# EAGLE design de1_breakout (EAGLE 6.5.0)
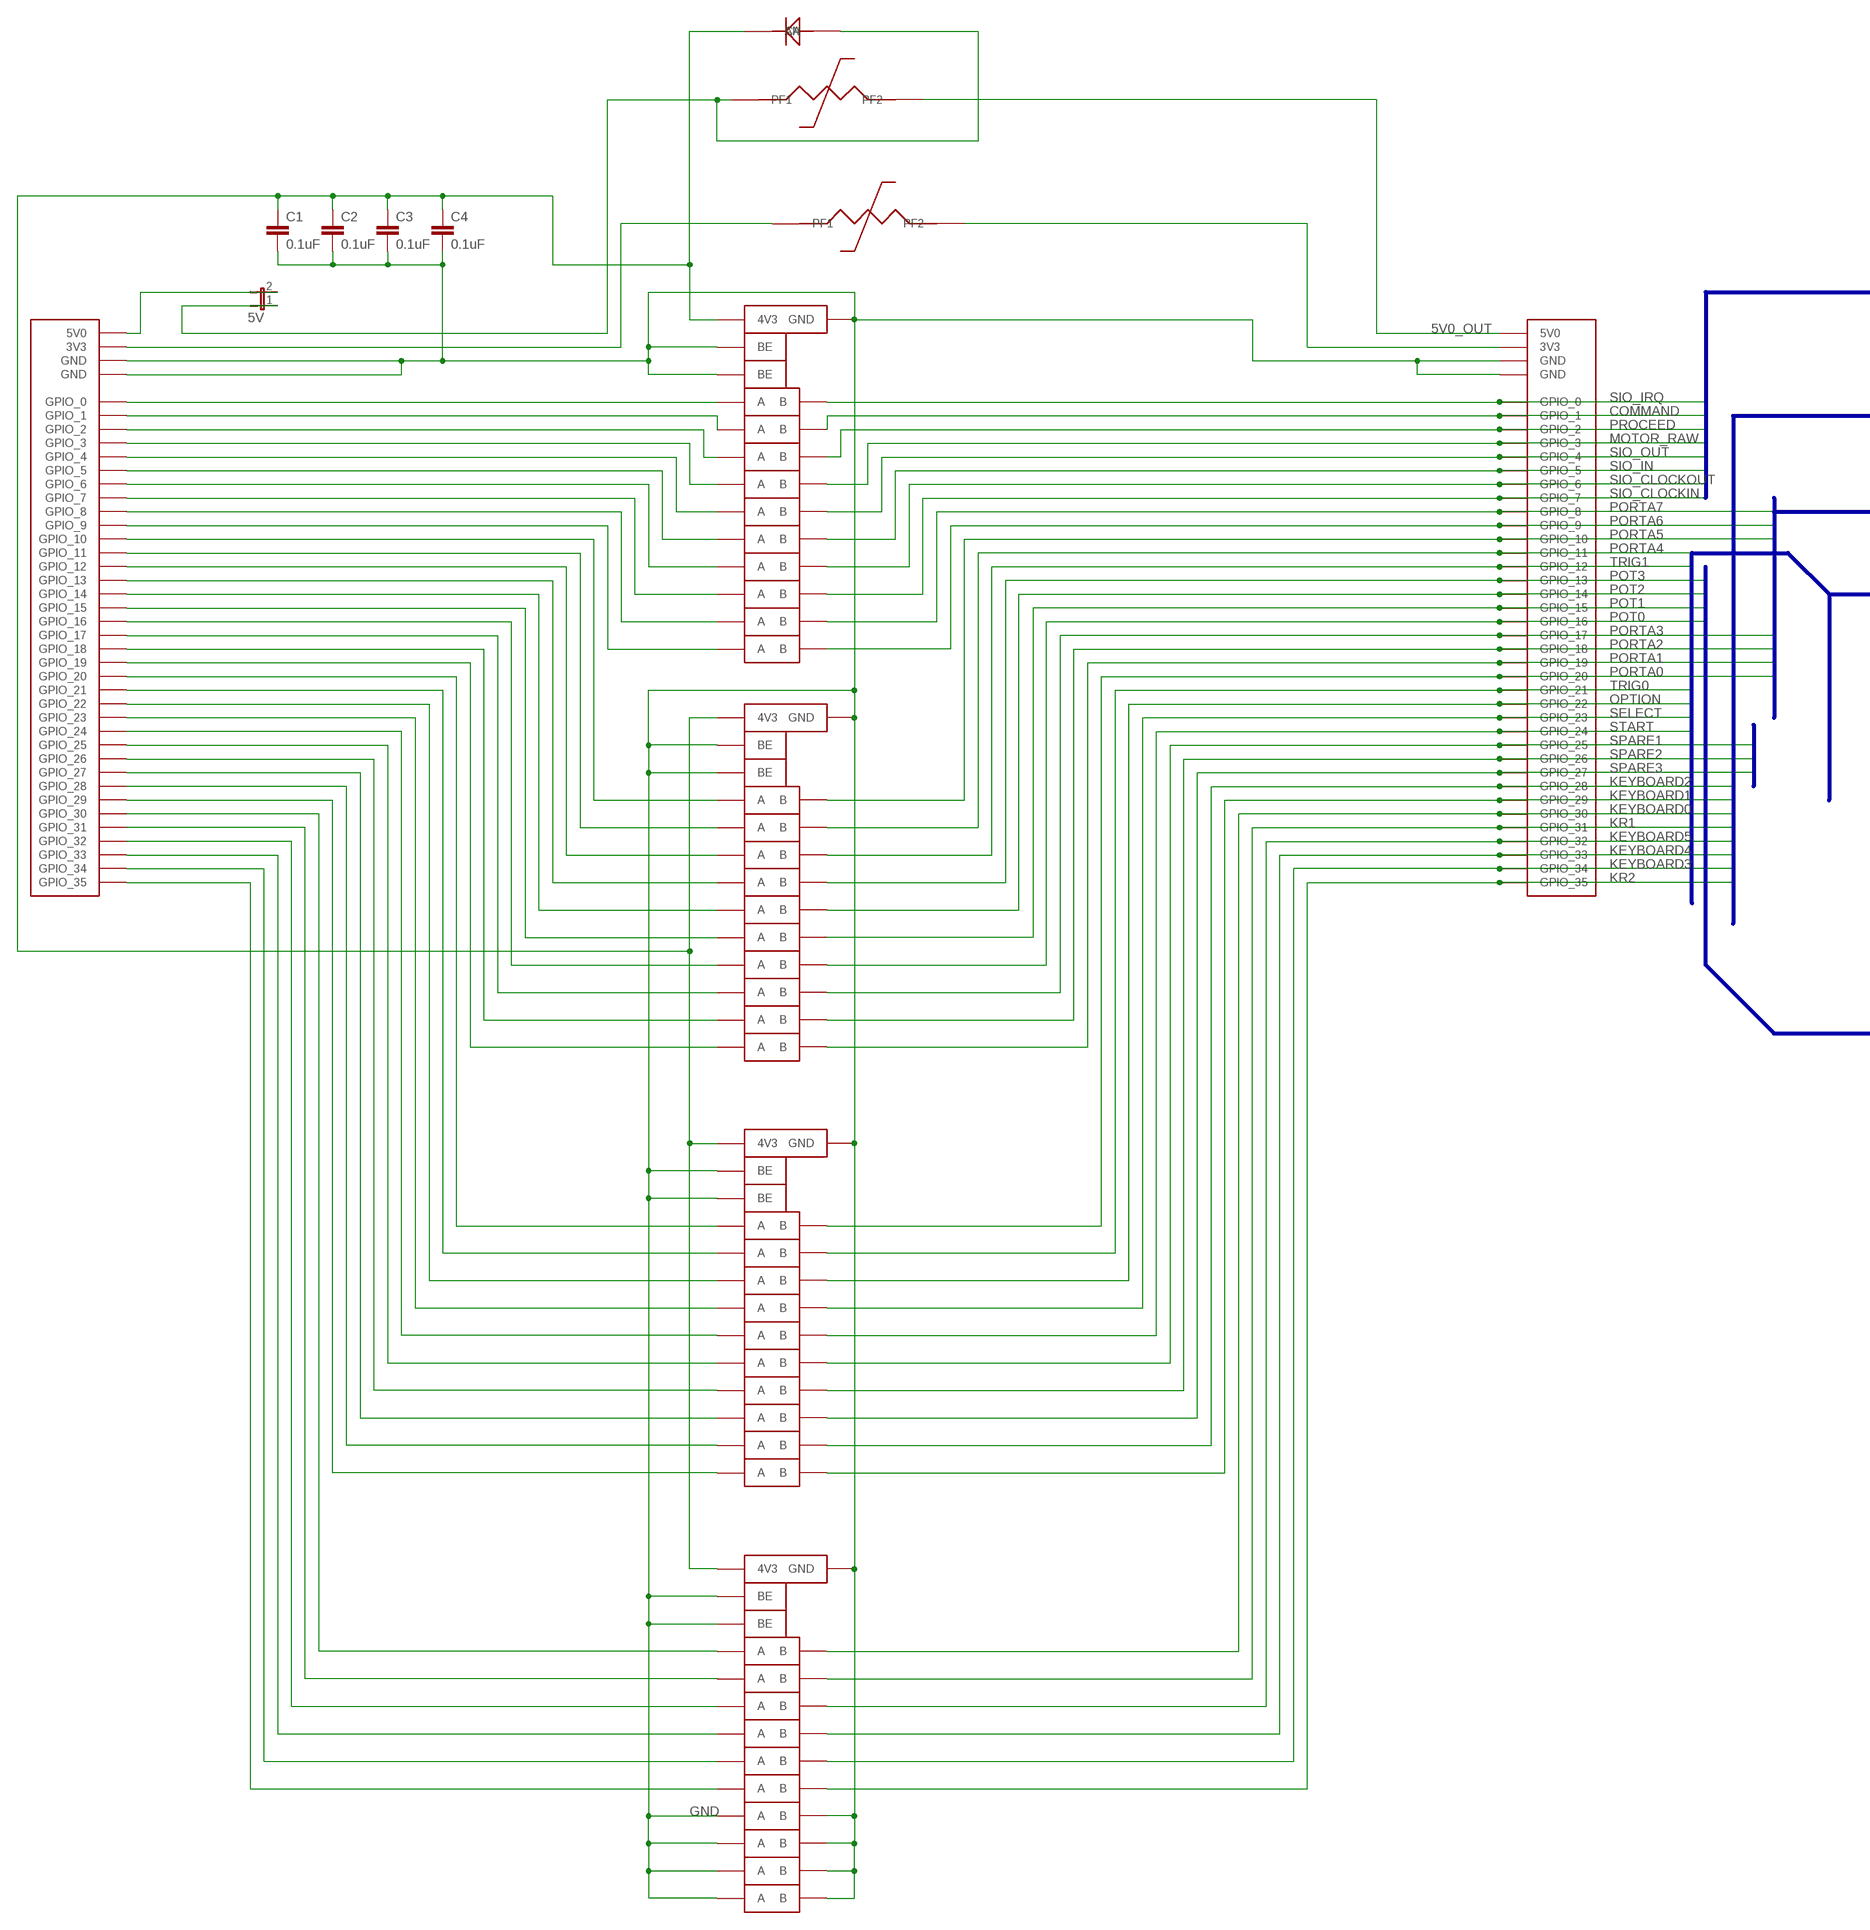
[diagram p0: schematic, sheet 1, part 1 of 2]
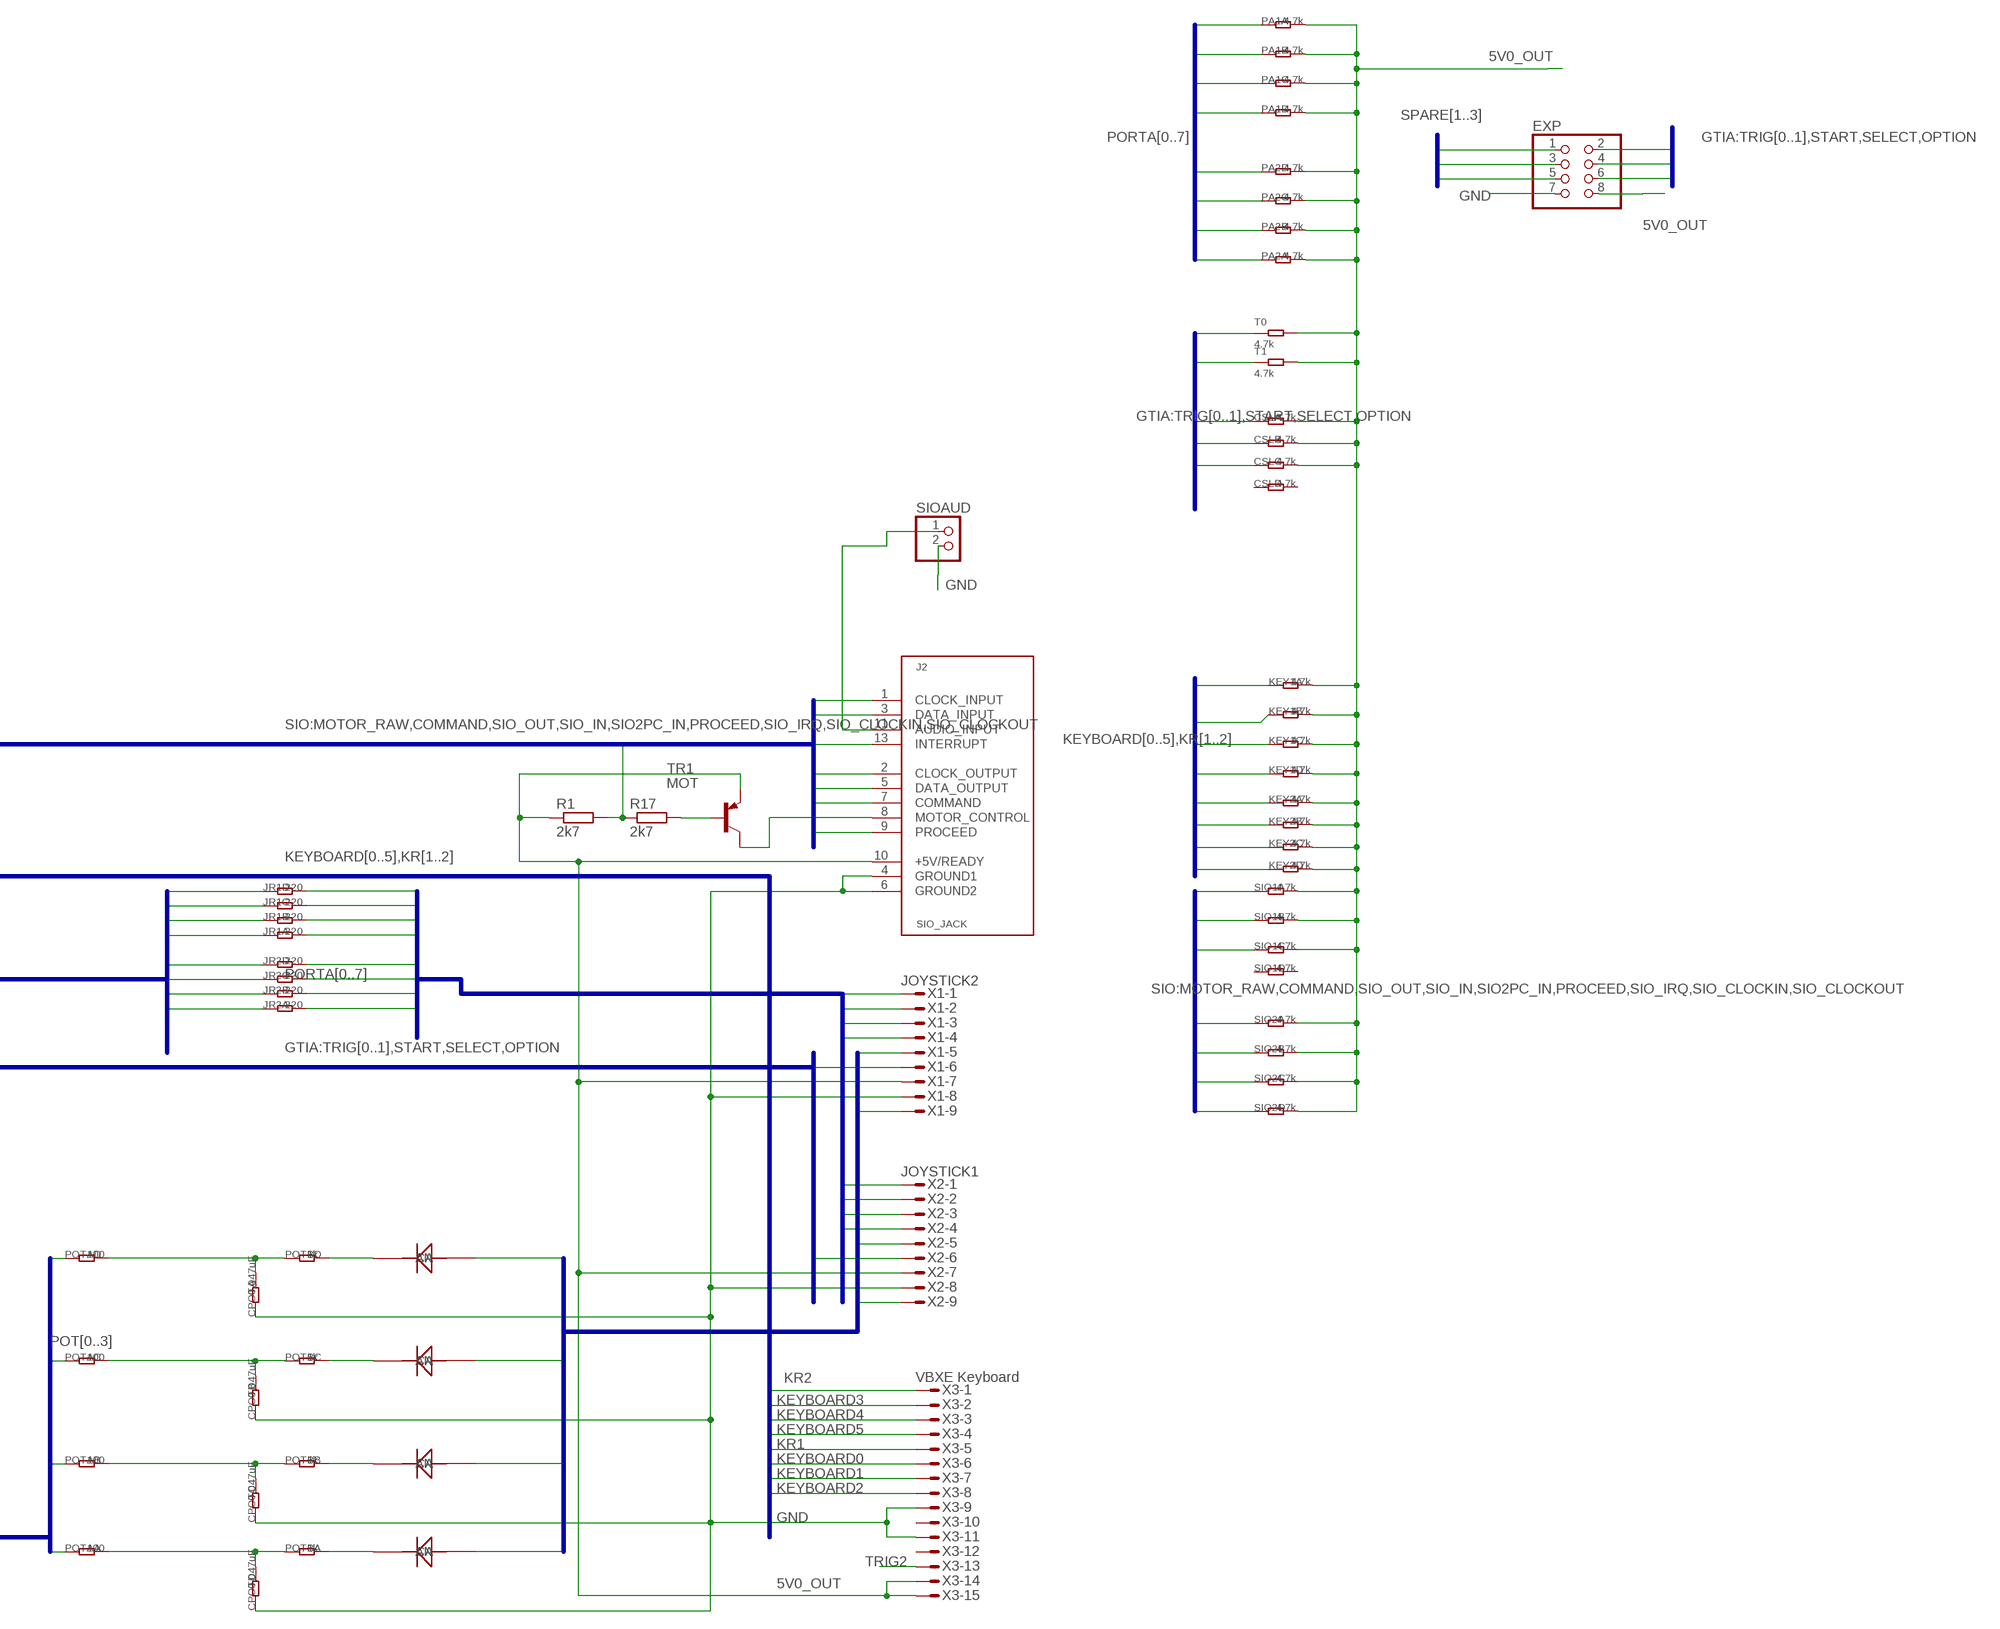
[diagram p1: schematic, sheet 1, part 2 of 2]

## Parts
3VPOLY  POLYFUSE_1206  [C1206]
5V  JP1E  [JP1]
5VPOLY  POLYFUSE_1206  [C1206]
C1  0.1uF  C-EUC1206  [C1206]
C2  0.1uF  C-EUC1206  [C1206]
C3  0.1uF  C-EUC1206  [C1206]
C4  0.1uF  C-EUC1206  [C1206]
CPOT  0.047uF  R-4R  [R1206-8]
CSL  4.7k  R-4R  [R1206-8]
D1  1N4148  [SOD123]
D2  1N4148  [SOD123]
D3  1N4148  [SOD123]
D4  1N4148  [SOD123]
D5  1N4148  [SOD123]
DE1_GPIO  DE1_GPIO  [DIL-100-2X20]
EXP  PINHD-2X4  [2X04]
EXT_GPIO  DE1_GPIO_L  [DIL-100-2X20]
IC1  QS3384  [TSSOP24]
IC2  QS3384  [TSSOP24]
IC3  QS3384  [TSSOP24]
IC4  QS3384  [TSSOP24]
J2  SIO_JACK  [SIO_JACK]
JR1  220  R-4R  [R1206-8]
JR2  220  R-4R  [R1206-8]
KEY1  4.7k  R-4R  [R1206-8]
KEY2  4.7k  R-4R  [R1206-8]
PA1  4.7k  R-4R  [R1206-8]
PA2  4.7k  R-4R  [R1206-8]
POTA  100  R-4R  [R1206-8]
POTB  1k  R-4R  [R1206-8]
R1  2k7  R-EU_M1206  [M1206]
R17  2k7  R-EU_M1206  [M1206]
SIO1  4.7k  R-4R  [R1206-8]
SIO2  4.7k  R-4R  [R1206-8]
SIOAUD  PINHD-1X2  [1X02]
T0  4.7k  RES-0603  [R0603]
T1  4.7k  RES-0603  [R0603]
TR1  MOT  BC857ASMD  [SOT23-BEC]
X1  JOYSTICK2  M09HPS  [M09HP]
X2  JOYSTICK1  M09HPS  [M09HP]
X3  VBXE Keyboard  M15HPS  [M15HP]

## Nets
3V3_IN: 3VPOLY.1(PF1) DE1_GPIO.29(3V3)
3V3_OUT: 3VPOLY.2(PF2) EXT_GPIO.29(3V3)
4V3_INT: C1.1 C2.1 C3.1 C4.1 D5.1(CA) IC1.24(4V3) IC2.24(4V3) IC3.24(4V3) IC4.24(4V3)
5V0_DE1: 5V.2 DE1_GPIO.11(5V0)
5V0_IN: 5V.1 5VPOLY.1(PF1) D5.2(AN)
5V0_OUT: 5VPOLY.2(PF2) CSL.6 CSL.7 CSL.8 EXP.8 EXT_GPIO.11(5V0) J2.10(+5V/READY) KEY1.5 KEY1.6 KEY1.7 KEY1.8 KEY2.5 KEY2.6 KEY2.7 KEY2.8 PA1.5 PA1.6 PA1.7 PA1.8 PA2.5 PA2.6 PA2.7 PA2.8 R1.1 SIO1.6 SIO1.7 SIO1.8 SIO2.5 SIO2.6 SIO2.7 SIO2.8 T0.2 T1.2 TR1.E X1.7 X2.7 X3.14 X3.15
COMMAND: EXT_GPIO.2(GPIO_1) IC1.5(B) J2.7(COMMAND) SIO1.2
GND: C1.2 C2.2 C3.2 C4.2 CPOT.1 CPOT.2 CPOT.3 CPOT.4 DE1_GPIO.12(GND) DE1_GPIO.30(GND) EXP.7 EXT_GPIO.12(GND) EXT_GPIO.30(GND) IC1.1(BEA:BE) IC1.12(GND) IC1.13(BEB:BE) IC2.1(BEA:BE) IC2.12(GND) IC2.13(BEB:BE) IC3.1(BEA:BE) IC3.12(GND) IC3.13(BEB:BE) IC4.1(BEA:BE) IC4.12(GND) IC4.13(BEB:BE) IC4.16(B) IC4.17(A) IC4.18(A) IC4.19(B) IC4.20(B) IC4.21(A) IC4.22(A) IC4.23(B) J2.4(GROUND1) J2.6(GROUND2) SIOAUD.2 X1.8 X2.8 X3.9 X3.11
KEYBOARD0: EXT_GPIO.35(GPIO_30) IC4.2(B) KEY2.3 X3.6
KEYBOARD1: EXT_GPIO.34(GPIO_29) IC3.23(B) KEY2.2 X3.7
KEYBOARD2: EXT_GPIO.33(GPIO_28) IC3.20(B) KEY2.1 X3.8
KEYBOARD3: EXT_GPIO.39(GPIO_34) IC4.10(B) KEY1.3 X3.2
KEYBOARD4: EXT_GPIO.38(GPIO_33) IC4.9(B) KEY1.2 X3.3
KEYBOARD5: EXT_GPIO.37(GPIO_32) IC4.6(B) KEY1.1 X3.4
KR1: EXT_GPIO.36(GPIO_31) IC4.5(B) KEY2.4 X3.5
KR2: EXT_GPIO.40(GPIO_35) IC4.15(B) KEY1.4 X3.1
MOTOR_RAW: EXT_GPIO.4(GPIO_3) IC1.9(B) R1.2 R17.1
N$2: DE1_GPIO.1(GPIO_0) IC1.3(A)
N$3: DE1_GPIO.2(GPIO_1) IC1.4(A)
N$4: DE1_GPIO.3(GPIO_2) IC1.7(A)
N$5: DE1_GPIO.4(GPIO_3) IC1.8(A)
N$6: DE1_GPIO.5(GPIO_4) IC1.11(A)
N$7: DE1_GPIO.6(GPIO_5) IC1.14(A)
N$8: DE1_GPIO.7(GPIO_6) IC1.17(A)
N$9: DE1_GPIO.8(GPIO_7) IC1.18(A)
N$10: DE1_GPIO.9(GPIO_8) IC1.21(A)
N$11: DE1_GPIO.10(GPIO_9) IC1.22(A)
N$12: DE1_GPIO.13(GPIO_10) IC2.3(A)
N$13: DE1_GPIO.14(GPIO_11) IC2.4(A)
N$14: DE1_GPIO.15(GPIO_12) IC2.7(A)
N$15: DE1_GPIO.16(GPIO_13) IC2.8(A)
N$16: DE1_GPIO.17(GPIO_14) IC2.11(A)
N$17: DE1_GPIO.18(GPIO_15) IC2.14(A)
N$18: DE1_GPIO.19(GPIO_16) IC2.17(A)
N$19: DE1_GPIO.20(GPIO_17) IC2.18(A)
N$20: DE1_GPIO.21(GPIO_18) IC2.21(A)
N$21: DE1_GPIO.22(GPIO_19) IC2.22(A)
N$22: DE1_GPIO.23(GPIO_20) IC3.3(A)
N$23: DE1_GPIO.24(GPIO_21) IC3.4(A)
N$24: DE1_GPIO.25(GPIO_22) IC3.7(A)
N$25: DE1_GPIO.26(GPIO_23) IC3.8(A)
N$26: DE1_GPIO.27(GPIO_24) IC3.11(A)
N$27: DE1_GPIO.28(GPIO_25) IC3.14(A)
N$28: DE1_GPIO.31(GPIO_26) IC3.17(A)
N$29: DE1_GPIO.32(GPIO_27) IC3.18(A)
N$30: DE1_GPIO.33(GPIO_28) IC3.21(A)
N$31: DE1_GPIO.34(GPIO_29) IC3.22(A)
N$32: DE1_GPIO.37(GPIO_32) IC4.7(A)
N$33: DE1_GPIO.35(GPIO_30) IC4.3(A)
N$34: DE1_GPIO.36(GPIO_31) IC4.4(A)
N$35: DE1_GPIO.38(GPIO_33) IC4.8(A)
N$36: DE1_GPIO.39(GPIO_34) IC4.11(A)
N$37: DE1_GPIO.40(GPIO_35) IC4.14(A)
N$38: CPOT.7 POTA.6 POTB.3
N$39: D2.1(CA) POTB.6
N$40: CPOT.6 POTA.7 POTB.2
N$41: D3.1(CA) POTB.7
N$42: CPOT.5 POTA.8 POTB.1
N$43: D4.1(CA) POTB.8
N$44: CPOT.8 POTA.5 POTB.4
N$45: D1.1(CA) POTB.5
N$46: R17.2 TR1.B
N$47: J2.8(MOTOR_CONTROL) TR1.C
OPTION: CSL.1 EXP.6 EXT_GPIO.25(GPIO_22) IC3.6(B)
PORTA0: EXT_GPIO.23(GPIO_20) IC3.2(B) JR1.4 PA1.4
PORTA1: EXT_GPIO.22(GPIO_19) IC2.23(B) JR1.3 PA1.3
PORTA2: EXT_GPIO.21(GPIO_18) IC2.20(B) JR1.2 PA1.2
PORTA3: EXT_GPIO.20(GPIO_17) IC2.19(B) JR1.1 PA1.1
PORTA4: EXT_GPIO.14(GPIO_11) IC2.5(B) JR2.4 PA2.4
PORTA5: EXT_GPIO.13(GPIO_10) IC2.2(B) JR2.3 PA2.3
PORTA6: EXT_GPIO.10(GPIO_9) IC1.23(B) JR2.2 PA2.2
PORTA7: EXT_GPIO.9(GPIO_8) IC1.20(B) JR2.1 PA2.1
PORTA_PROT0: JR1.5 X2.1
PORTA_PROT1: JR1.6 X2.2
PORTA_PROT2: JR1.7 X2.3
PORTA_PROT3: JR1.8 X2.4
PORTA_PROT4: JR2.5 X1.1
PORTA_PROT5: JR2.6 X1.2
PORTA_PROT6: JR2.7 X1.3
PORTA_PROT7: JR2.8 X1.4
POT0: EXT_GPIO.19(GPIO_16) IC2.16(B) POTA.4
POT1: EXT_GPIO.18(GPIO_15) IC2.15(B) POTA.3
POT2: EXT_GPIO.17(GPIO_14) IC2.10(B) POTA.2
POT3: EXT_GPIO.16(GPIO_13) IC2.9(B) POTA.1
POTIN0: D1.2(AN) X2.9
POTIN1: D2.2(AN) X2.5
POTIN2: D3.2(AN) X1.9
POTIN3: D4.2(AN) X1.5
PROCEED: EXT_GPIO.3(GPIO_2) IC1.6(B) J2.9(PROCEED) SIO1.3
SELECT: CSL.2 EXP.4 EXT_GPIO.26(GPIO_23) IC3.9(B)
SIO_CLOCKIN: EXT_GPIO.8(GPIO_7) IC1.19(B) J2.1(CLOCK_INPUT) SIO2.4
SIO_CLOCKOUT: EXT_GPIO.7(GPIO_6) IC1.16(B) J2.2(CLOCK_OUTPUT) SIO2.3
SIO_IN: EXT_GPIO.6(GPIO_5) IC1.15(B) J2.3(DATA_INPUT) SIO2.2
SIO_IRQ: EXT_GPIO.1(GPIO_0) IC1.2(B) J2.13(INTERRUPT) SIO1.1
SIO_OUT: EXT_GPIO.5(GPIO_4) IC1.10(B) J2.5(DATA_OUTPUT) SIO2.1
SIOAUD: J2.11(AUDIO_INPUT) SIOAUD.1
SPARE1: EXP.1 EXT_GPIO.28(GPIO_25) IC3.15(B)
SPARE2: EXP.3 EXT_GPIO.31(GPIO_26) IC3.16(B)
SPARE3: EXP.5 EXT_GPIO.32(GPIO_27) IC3.19(B)
START: CSL.3 EXP.2 EXT_GPIO.27(GPIO_24) IC3.10(B)
TRIG0: EXT_GPIO.24(GPIO_21) IC3.5(B) T0.1 X2.6
TRIG1: EXT_GPIO.15(GPIO_12) IC2.6(B) T1.1 X1.6
TRIG2: X3.13
Unconnected: CSL.4 CSL.5 SIO1.4 SIO1.5 X3.10 X3.12

## Buses
PORTA[0..7]
KEYBOARD[0..5],KR[1..2]
SIO:MOTOR_RAW,COMMAND,SIO_OUT,SIO_IN,SIO2PC_IN,PROCEED,SIO_IRQ,SIO_CLOCKIN,SIO_CLOCKOUT
POT[0..3]
GTIA:TRIG[0..1],START,SELECT,OPTION
POTIN[0..3]
SPARE[1..3]
PORTA_PROT[0..7]

## Library data of the parts
3VPOLY 5VPOLY = quickswitch:POLYFUSE_1206
5V = jumper:JP1E: JUMPER
C1-C4 = rcl:C-EU: CAPACITOR, European symbol
CPOT CSL JR1 JR2 KEY1 KEY2 PA1 PA2 POTA POTB SIO1 SIO2 = Discrete:R-4R*: Resistor Array
D1-D4 = de1_parts:1N4148
D5 = quickswitch:1N4148
DE1_GPIO = quickswitch:DE1_GPIO
EXP = pinhead:PINHD-2X4: PIN HEADER
EXT_GPIO = quickswitch:DE1_GPIO_L
IC1-IC4 = quickswitch:QS3384: IDT Quickswitch - 3.3V/5V conversion
J2 = atari:SIO_JACK: SIO Jack
R1 R17 = rcl:R-EU_: RESISTOR, European symbol
SIOAUD = pinhead:PINHD-1X2: PIN HEADER
T0 T1 = Discrete:RES
TR1 = transistor-pnp:BC857*: PNP Transistror
X1 X2 = con-subd:M09?S: SUB-D; OC_FARNELL: unknown; OC_NEWARK: unknown
X3 = con-subd:M15?S: SUB-D; OC_FARNELL: unknown; OC_NEWARK: unknown

## Board
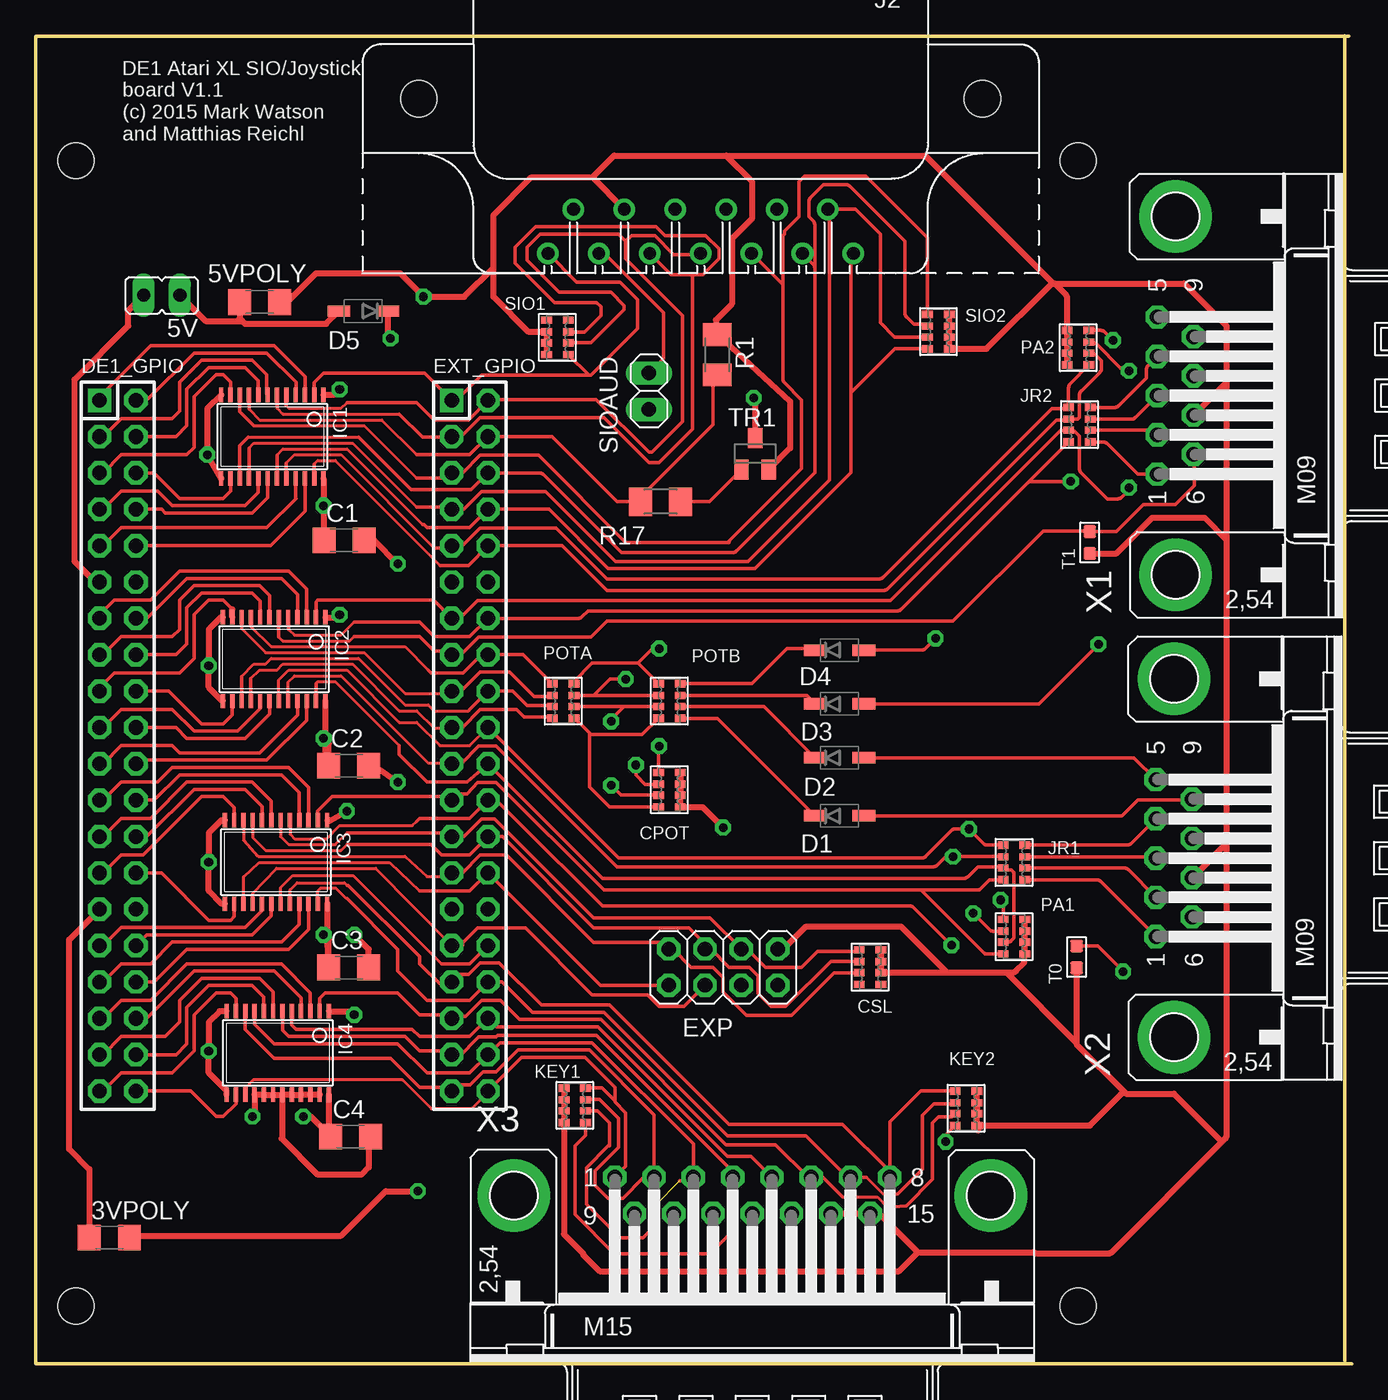
[diagram p2: board, top side]
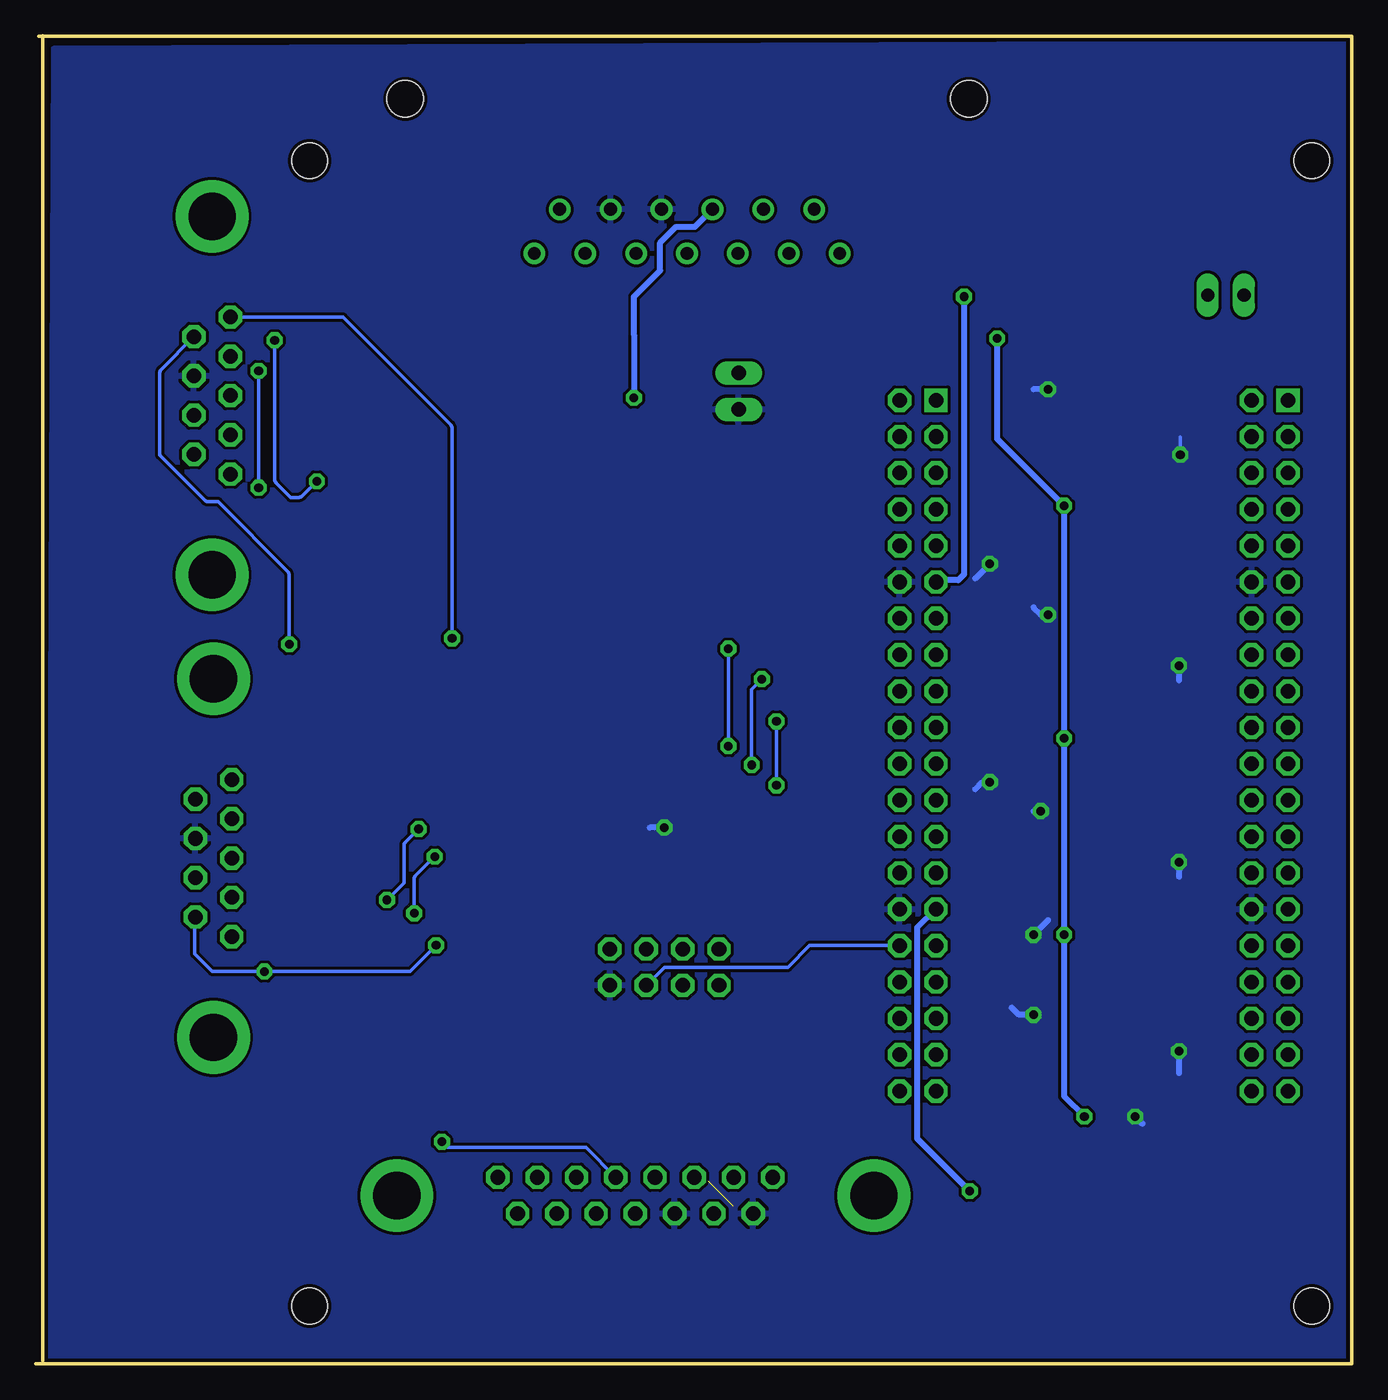
[diagram p3: board, bottom side, seen from below]

Size 91.93 x 92.76 mm. Coordinates in mm from the lower left corner, seen from the top.
Outline: 91.73,92.72 0,92.72 0,0 91.93,0
Outline: 91.44,0.2 91.44,92.76
Copper layers (1*16): Top 0.035mm / dielectric 1.5mm / Bottom 0.035mm
Design rules "sparkfun": minimum track width 8mil, minimum drill 20mil, track to track 8mil, track to pad 8mil, pad to pad 8mil, via to via 8mil, smd to smd 8mil, copper to edge 10mil, drill to drill 8mil, minimum pad ring 12mil, minimum via ring 10mil, stop-mask expansion 4mil, vias tented up to drill 25mil, thermal gap 10mil
Holes 2.5 mm at 2.8,84.03 2.8,4.03 72.8,4.03 72.8,84.03

### Footprints (pad centres in the part's own frame; a part is rotated, then mirrored left to right if it is on the bottom)
C1206 = smd 1.6 x 1.8: 1 -1.4,0; 2 1.4,0
JP1 = drill 0.914 long: 1 0,-1.27; 2 0,1.27
R1206-8 = smd 0.508 x 0.762: 1 -1.206,-0.762; 2 -0.381,-0.762; 3 0.381,-0.762; 4 1.206,-0.762; 5 1.206,0.762; 6 0.381,0.762; 7 -0.381,0.762; 8 -1.206,0.762
SOD123 = smd 1.6 x 0.8: 1 -1.7,0; 2 1.7,0
DIL-100-2X20 = drill 1.016 square: 1 -24.13,-1.27 | drill 1.016 octagon: 2 -24.13,1.27; 3 -21.59,-1.27; 4 -21.59,1.27; 5 -19.05,-1.27; 6 -19.05,1.27; 7 -16.51,-1.27; 8 -16.51,1.27; 9 -13.97,-1.27; 10 -13.97,1.27; 11 -11.43,-1.27; 12 -11.43,1.27; 13 -8.89,-1.27; 14 -8.89,1.27; 15 -6.35,-1.27; 16 -6.35,1.27; 17 -3.81,-1.27; 18 -3.81,1.27; 19 -1.27,-1.27; 20 -1.27,1.27; 21 1.27,-1.27; 22 1.27,1.27; 23 3.81,-1.27; 24 3.81,1.27; 25 6.35,-1.27; 26 6.35,1.27; 27 8.89,-1.27; 28 8.89,1.27; 29 11.43,-1.27; 30 11.43,1.27; 31 13.97,-1.27; 32 13.97,1.27; 33 16.51,-1.27; 34 16.51,1.27; 35 19.05,-1.27; 36 19.05,1.27; 37 21.59,-1.27; 38 21.59,1.27; 39 24.13,-1.27; 40 24.13,1.27
2X04 = drill 1.016 octagon: 1 -3.81,-1.27; 2 -3.81,1.27; 3 -1.27,-1.27; 4 -1.27,1.27; 5 1.27,-1.27; 6 1.27,1.27; 7 3.81,-1.27; 8 3.81,1.27
TSSOP24 = smd 0.305 x 0.991: 1 -3.575,-2.918; 2 -2.925,-2.918; 3 -2.275,-2.918; 4 -1.625,-2.918; 5 -0.975,-2.918; 6 -0.325,-2.918; 7 0.325,-2.918; 8 0.975,-2.918; 9 1.625,-2.918; 10 2.275,-2.918; 11 2.925,-2.918; 12 3.575,-2.918; 13 3.575,2.918; 14 2.925,2.918; 15 2.275,2.918; 16 1.625,2.918; 17 0.975,2.918; 18 0.325,2.918; 19 -0.325,2.918; 20 -0.975,2.918; 21 -1.625,2.918; 22 -2.275,2.918; 23 -2.925,2.918; 24 -3.575,2.918
SIO_JACK = drill 0.9: 1 -11.938,10.795; 2 -10.16,7.715; 3 -8.382,10.795; 4 -6.604,7.715; 5 -4.826,10.795; 6 -3.048,7.715; 7 -1.27,10.795; 8 0.508,7.715; 9 2.286,10.795; 10 4.064,7.715; 11 5.842,10.795; 12 7.62,7.715; 13 9.398,10.795 | hole 2.54: -20.955,0; 18.415,0
M1206 = smd 1.6 x 2: 1 -1.4,0; 2 1.4,0
1X02 = drill 1.016 long: 1 -1.27,0; 2 1.27,0
R0603 = smd 0.889 x 0.889: 1 0,0.762; 2 0,-0.762
SOT23-BEC = smd 1 x 1.4: B -0.95,-1.1; C 0,1.1; E 0.95,-1.1
M09HP = drill 1.016 octagon: 1 -5.486,1.27; 2 -2.743,1.27; 3 0,1.27; 4 2.743,1.27; 5 5.486,1.27; 6 -4.115,-1.27; 7 -1.372,-1.27; 8 1.372,-1.27; 9 4.115,-1.27 | drill 3.302 pad 5.08: G1 -12.522,0; G2 12.522,0
M15HP = drill 1.016 octagon: 1 -9.601,1.27; 2 -6.858,1.27; 3 -4.115,1.27; 4 -1.372,1.27; 5 1.372,1.27; 6 4.115,1.27; 7 6.858,1.27; 8 9.601,1.27; 9 -8.23,-1.27; 10 -5.486,-1.27; 11 -2.743,-1.27; 12 0,-1.27; 13 2.743,-1.27; 14 5.486,-1.27; 15 8.23,-1.27 | drill 3.302 pad 5.08: G1 -16.662,0; G2 16.662,0

### Placement (x,y rotation side)
3VPOLY  5.15,8.81 0 top
5V  8.8,74.64 90 top
5VPOLY  15.64,74.16 0 top
C1  21.53,57.52 0 top
C2  21.86,41.78 0 top
C3  21.86,27.68 0 top
C4  21.99,15.87 0 top
CPOT  44.26,40.1 90 top
CSL  58.28,27.7 270 top
D1  56.14,38.27 0 top
D2  56.14,42.33 0 top
D3  56.14,46.09 0 top
D4  56.14,49.85 0 top
D5  22.87,73.53 180 top
DE1_GPIO  5.73,43.17 270 top
EXP  48.02,27.7 0 top
EXT_GPIO  30.32,43.17 270 top
IC1  16.52,64.76 180 top
IC2  16.65,49.22 180 top
IC3  16.78,35.05 180 top
IC4  16.91,21.71 180 top
J2  45.17,88.36 180 top
JR1  68.34,35.02 270 top
JR2  72.91,65.6 270 top
KEY1  37.65,18.05 90 top
KEY2  64.98,17.84 270 top
PA1  68.34,29.83 270 top
PA2  72.81,70.98 90 top
POTA  36.84,46.29 270 top
POTB  44.26,46.29 270 top
R1  47.61,70.47 270 top
R17  43.65,60.21 0 top
SIO1  36.43,71.69 90 top
SIO2  63.05,72.1 270 top
SIOAUD  42.83,67.93 270 top
T0  72.7,28.41 0 top
T1  73.62,57.37 0 top
TR1  50.25,63.56 0 top
X1  79.61,67.63 90 top
X2  79.51,35.32 90 top
X3  50.05,11.75 0 top

### Tracks (layer width: path | path; a pad name or v marks a point on that pad's centre or on a via)
3V3_IN
  Top 0.406: DE1_GPIO.29 2.33,29.61 2.33,15.01 3.75,13.59 3VPOLY.1
3V3_OUT  (via drill 0.6)
  Top 0.406: 3VPOLY.2 6.68,8.94 21.34,8.94 24.45,12.06 v26.69,12.06
  Bottom 0.406: EXT_GPIO.29 29.1,31.74 30.37,30.47 30.37,15.74 v26.69,12.06
4V3_INT  (via drill 0.6)
  Top 0.406: IC2.24 20.23,42.01 C2.1 20.46,43.32 v20.1,43.68 | IC3.24 20.35,29.31 C3.1 20.46,29.61 v20.1,29.97 | D5.1 24.58,71.83 v24.78,71.62 | v18.68,17.27 19.19,17.27 20.48,15.97 | 20.48,15.97 C4.1 | 20.48,15.97 IC4.24 | C1.1 20.1,57.55 v20.1,59.94 IC1.24
  Bottom 0.406: v24.78,71.62 24.78,64.62 v20.1,59.94 v20.1,43.68 v20.1,29.97 20.1,18.68 v18.68,17.27
5V0_DE1
  Top 0.406: 4.45,54.6 DE1_GPIO.11 4.15,54.6 2.7,56.05 2.7,68.75 6.46,72.51 6.46,73.57 5V.2
5V0_IN
  Top 0.406: 20.59,73.53 D5.2 20.29,72.64 14.62,72.64 14.42,72.84 | 5VPOLY.1 14.24,73.02 14.42,72.84 | 5V.1 11.87,72.84 14.42,72.84
5V0_OUT  (via drill 0.6)
  Top 0.406: 5VPOLY.2 17.57,74.16 19.57,76.16 25.46,76.16 v27.09,74.54 29.93,74.54 31.96,76.57 | 31.96,76.57 31.96,80.23 34.61,82.87 38.88,82.87 | 38.88,82.87 J2.10 | SIO2.5 SIO2.6 | SIO2.5 SIO2.7 SIO2.8 | SIO2.5 66.42,70.89 70.98,75.45 71.08,75.45 | 71.08,75.45 71.18,75.45 | 71.18,75.45 80.22,75.45 83.17,72.51 83.17,68.54 | 83.17,68.54 X1.7 | 48.22,84.39 40.4,84.39 38.88,82.87 | 48.22,84.39 62.14,84.39 71.08,75.45 | 83.17,68.54 83.17,57.57 | 83.17,57.57 83.17,36.34 | PA1.8 PA1.7 PA1.6 PA1.5 arc45 69.05,28.5 69.05,28.01 68.48,27.44 arc-45 68.19,27.32 67.8,27.32 | T0.2 72.71,22.42 | 72.71,22.42 72.71,22.32 76.01,19.01 | 76.01,19.01 76.16,18.86 79.51,18.86 82.87,15.51 | T1.2 75.5,56.61 77.99,59.09 81.65,59.09 83.17,57.57 | 83.17,36.34 X2.7 | CSL.8 CSL.7 CSL.6 63.66,27.32 | EXP.8 52.23,28.97 53.81,30.55 60.44,30.55 63.66,27.32 | X3.14 X3.15 58.94,10.48 61.63,7.79 | KEY1.8 KEY1.7 KEY1.6 KEY1.5 36.89,9.06 38.26,7.69 38.26,7.58 39.38,6.47 60.31,6.47 61.63,7.79 | KEY2.5 KEY2.6 KEY2.7 KEY2.8 | KEY2.5 73.63,16.64 76.01,19.01 | SIO1.8 SIO1.7 SIO1.6 34.43,72.07 31.96,74.54 31.96,76.57 | 63.66,27.32 67.8,27.32 | 67.8,27.32 72.71,22.42 | 48.22,84.39 50.05,82.56 50.05,80.02 48.63,78.6 48.63,74.03 47.51,72.91 47.51,71.98 R1.1 52.69,67.22 52.69,63.95 TR1.E | 71.18,75.45 71.93,74.71 arc-45 72.04,74.42 PA2.5 PA2.6 PA2.7 PA2.8 | 83.17,36.34 83.17,15.92 arc-45 83.1,15.74 82.87,15.51 | 82.87,15.51 75.12,7.76 arc-45 75,7.71 69.83,7.71 arc45 69.65,7.79 61.63,7.79 | KEY2.5 65.75,16.48 arc45 65.82,16.3
  Bottom 0.406: v27.09,74.54 27.09,55.13 27.49,54.73 28.93,54.73 EXT_GPIO.11
COMMAND
  Top 0.203: 17.5,66.91 17.67,66.75 21.33,66.75 21.73,67.15
  Top 0.254: IC1.5 17.5,66.91 | 21.73,67.15 26.61,67.15 27.83,65.93 30.22,65.93 EXT_GPIO.2 31.59,67.35 39.15,67.35 42.83,63.67 43.04,63.67 45.17,65.8 45.17,73.22 41.21,77.18 41.21,78.4 | 41.21,78.4 41.62,78.81 43.24,78.81 44.56,77.48 46.37,77.48 J2.7 | SIO1.2 38.8,71.31 41.11,73.62 41.11,73.93 40.19,74.84 36.54,74.84 34.3,77.08 34.3,77.99 35.21,78.91 40.7,78.91 41.21,78.4
GND  (via drill 0.6)
  Top 0.406: IC1.13 v11.98,63.49 11.98,66.75 IC1.12 | IC2.12 12.92,52.14 12.08,51.3 v12.08,48.76 12.08,47.24 13.02,46.3 IC2.13 | IC3.12 12.97,37.96 12.08,37.08 v12.08,35.05 12.08,33.01 12.97,32.13 IC3.13 | IC4.12 12.84,24.63 12.08,23.87 v12.08,21.84 12.08,20.31 13.33,19.06 IC4.13 | C4.2 23.26,15.74 23.26,13.71 22.75,13.2 19.7,13.2 17.16,15.74 17.23,15.81 IC4.19 | IC4.23 IC4.22 IC4.21 IC4.20 IC4.19 | IC4.19 IC4.18 IC4.17 IC4.16 15.28,17.42 v15.13,17.27 | C1.2 23.64,57.53 v25.29,55.87 | C2.2 23.64,41.78 v25.29,40.63 | C3.2 23.26,28.95 v22.24,29.97 | IC2.1 21.04,52.14 v21.22,52.32 | IC1.1 20.84,67.68 v21.22,68.07 | IC3.1 20.59,37.96 v21.73,38.6 | IC4.1 21.99,24.63 v22.24,24.38 | CPOT.4 CPOT.3 CPOT.2 CPOT.1 46.58,38.89 v48.02,37.45
  Bottom 0.254: v11.98,63.49 11.98,64.71
  Bottom 0.406: v12.08,48.76 12.08,47.75 | v12.08,35.05 12.08,34.03 | v12.08,21.84 12.08,20.31 | v15.13,17.27 14.62,16.76 | v25.29,55.87 26.3,54.86 | v25.29,40.63 25.8,40.63 26.3,40.13 | v22.24,29.97 21.22,30.98 | v21.22,52.32 21.73,52.32 22.24,52.83 | v21.22,68.07 22.24,68.07 | v21.73,38.6 22.24,38.6 | v22.24,24.38 23.26,24.38 23.76,24.89 | v48.02,37.45 49.03,37.45
  pour Bottom: 0.08,92.23 90.69,91.85 91.1,0.01 0.4,0.44
KEYBOARD0
  Top 0.203: 56.35,11.65 58.79,11.65 59.5,10.94
  Top 0.254: IC4.2 19.83,25.53 20.21,25.9 25.29,25.9 26.81,24.38 28.79,24.38 EXT_GPIO.35 29.17,24.25 30.03,24.25 31.15,25.36 32.47,25.36 33.79,24.04 39.48,24.04 48.22,15.31 51.67,15.31 53.96,13.02 X3.6 54.98,13.02 56.35,11.65 | 59.5,10.94 60.82,11.04 62.65,12.87 62.65,16.83 63.05,17.24 63.99,17.24 KEY2.3
KEYBOARD1
  Top 0.203: IC3.23 19.7,33.02 19.87,33.19 20.99,33.19 21.67,32.51 21.73,32.51 | 58.02,13.02 59.19,11.85 60.21,11.85
  Top 0.254: 21.73,32.51 25.29,28.95 25.29,27.43 27.32,25.39 30.32,25.39 EXT_GPIO.34 31.61,26.68 32.57,26.68 34.71,24.55 39.69,24.55 48.32,15.91 53.81,15.91 56.7,13.02 X3.7 58.02,13.02 | 60.21,11.85 61.94,13.58 61.94,17.34 62.75,18.15 64.15,18.15 KEY2.2
KEYBOARD2
  Top 0.203: IC3.20 17.75,33.1 | 17.75,33.1 | 17.75,33.1 18.25,33.59 21.56,33.59 21.73,33.42
  Top 0.254: 21.73,33.42 21.83,33.42 26.81,28.44 26.81,27.93 28.34,26.41 28.79,26.41 EXT_GPIO.33 29.58,27.19 30.24,27.19 31.05,28.01 32.37,28.01 35.32,25.06 40.09,25.06 48.42,16.73 56.35,16.73 59.65,13.43 | X3.8 59.65,13.43 | 59.65,13.43 59.65,16.88 61.83,19.06 64.21,19.06 KEY2.1
KEYBOARD3
  Top 0.254: IC4.10 14.63,23.35 16.65,21.33 24.78,21.33 26.81,19.3 28.79,19.3 EXT_GPIO.39 29.47,19.47 30.34,19.47 31.25,20.39 32.17,20.39 33.69,21.91 38.67,21.91 43.19,17.39 X3.2 43.14,12.97 42.43,12.97 41.01,11.55 39.99,11.55 39.08,12.46 39.08,13.48 40.7,15.1 40.7,17.13 39.38,18.45 38.44,18.45 KEY1.3
KEYBOARD4  (1 unrouted)
  Top 0.254: IC4.9 15.28,23.72 16.65,22.35 25.29,22.35 27.32,20.31 30.32,20.31 EXT_GPIO.38 32.42,22.42 38.87,22.42 45.93,15.36 X3.3 45.68,12.77 44.97,12.77 | KEY1.2 39.25,17.67 40.09,16.83 40.09,15.2 39.99,15.2 38.47,13.68 38.47,11.14 40.8,8.8 42.43,8.8 43.24,9.62 43.24,11.04
KEYBOARD5
  Top 0.254: IC4.6 17.23,23.29 17.67,22.85 25.8,22.85 26.81,21.84 28.79,21.84 EXT_GPIO.37 29.23,21.4 29.53,21.4 30.95,22.82 32.17,22.82 32.27,22.93 39.18,22.93 48.68,13.43 X3.4 48.63,12.97 48.63,9.21 47.1,7.69 40.4,7.69 37.65,10.43 37.65,15.2 38.42,15.97 KEY1.1
KR1  (via drill 0.6)
  Top 0.254: IC4.5 17.88,23.66 18.18,23.36 26.3,23.36 26.81,22.85 30.32,22.85 EXT_GPIO.36 32.18,23.53 39.28,23.53 48.32,14.49 49.95,14.49 X3.5 | v63.56,15.51 63.56,15.98 KEY2.4
  Bottom 0.254: v63.56,15.51 63.15,15.1 53.5,15.1 X3.5
KR2
  Top 0.203: IC4.15 14.69,18.81 14.69,19.32 15.2,19.83 25.61,19.83 27.65,17.79 30.44,17.79 31.46,18.81 EXT_GPIO.40
  Top 0.254: 40.45,18.35 40.45,19.32 38.36,21.4 33.94,21.4 EXT_GPIO.40 | KEY1.4 39.55,19.25 40.45,18.35 | 40.45,18.35 40.45,18.3 41.21,17.54 41.21,13.78 X3.1
MOTOR_RAW
  Top 0.203: 14.9,66.67 15.64,65.93 24.17,65.93 26.61,63.49
  Top 0.254: IC1.9 14.9,66.67 | 26.61,63.49 30.32,63.49 EXT_GPIO.4 36.05,64.76 40.6,60.21 R17.1 42.25,60.54 47.31,65.6 47.31,68.77 R1.2
N$2
  Top 0.254: DE1_GPIO.1 4.46,67.56 8.02,71.11 16.65,71.11 18.8,68.97 IC1.3
N$3
  Top 0.254: DE1_GPIO.2 7.76,67.3 11.06,70.61 16.14,70.61 18.18,68.57 18.18,67.71 IC1.4
N$4
  Top 0.254: DE1_GPIO.3 4.71,64.76 5.98,66.03 9.54,66.03 10.05,66.54 10.05,68.57 11.57,70.1 15.13,70.1 16.14,69.08 16.14,67.74 IC1.7
N$5
  Top 0.254: DE1_GPIO.4 9.79,64.76 10.56,65.53 10.56,68.07 12.08,69.59 14.62,69.59 15.55,68.66 IC1.8
N$6
  Top 0.254: DE1_GPIO.5 4.71,62.22 5.98,63.49 10.56,63.49 11.06,64 11.06,67.56 12.59,69.08 13.1,69.08 13.6,68.57 IC1.11
N$7
  Top 0.254: DE1_GPIO.6 8.27,62.22 10.05,60.45 13.1,60.45 13.6,60.95 IC1.14
N$8
  Top 0.254: DE1_GPIO.7 4.71,59.68 5.98,60.95 8.52,60.95 9.54,59.94 14.62,59.94 15.55,60.87 IC1.17
N$9
  Top 0.254: DE1_GPIO.8 8.78,59.68 9.03,59.43 15.13,59.43 16.2,60.5 IC1.18
N$10
  Top 0.254: DE1_GPIO.9 4.71,57.14 5.98,58.41 16.14,58.41 18.18,60.45 18.15,60.47 IC1.21
N$11
  Top 0.254: DE1_GPIO.10 16.4,57.14 18.8,59.55 IC1.22
N$12
  Top 0.254: DE1_GPIO.13 4.46,52.32 5.48,53.33 8.02,53.33 10.05,55.37 17.67,55.37 18.93,54.11 IC2.3
N$13
  Top 0.254: DE1_GPIO.14 7.76,52.06 10.56,54.86 17.16,54.86 18.28,53.74 IC2.4
N$14
  Top 0.254: DE1_GPIO.15 4.71,49.52 5.98,50.79 9.54,50.79 10.05,51.3 10.05,53.33 11.06,54.35 15.64,54.35 16.33,53.66 IC2.7
N$15
  Top 0.254: DE1_GPIO.16 9.79,49.52 10.56,50.29 10.56,52.83 11.57,53.84 15.13,53.84 15.68,53.29 IC2.8
N$16
  Top 0.254: DE1_GPIO.17 4.46,47.24 5.48,48.25 10.05,48.25 11.06,49.27 11.06,52.32 12.08,53.33 13.1,53.33 13.73,52.7
  Top 0.406: IC2.11 13.73,52.7
N$17
  Top 0.254: IC2.14 13.73,45.33 13.1,44.7 11.57,44.7 9.29,46.98 DE1_GPIO.18
N$18
  Top 0.254: DE1_GPIO.19 4.71,44.44 5.98,45.71 9.54,45.71 11.06,44.19 14.11,44.19 15.68,45.76 IC2.17
N$19
  Top 0.254: DE1_GPIO.20 9.79,44.44 10.56,43.68 14.62,43.68 16.33,45.39 IC2.18
N$20
  Top 0.254: DE1_GPIO.21 4.71,41.9 5.98,43.17 9.54,43.17 10.05,42.67 15.64,42.67 18.28,45.31 IC2.21
N$21
  Top 0.254: IC2.22 18.93,44.94 16.14,42.16 7.25,42.16 DE1_GPIO.22
N$22
  Top 0.254: DE1_GPIO.23 4.71,39.36 5.98,40.63 8.52,40.63 9.54,41.65 17.67,41.65 19.05,40.26 IC3.3
N$23
  Top 0.254: DE1_GPIO.24 8.27,39.36 10.05,41.14 17.16,41.14 18.4,39.9 IC3.4
N$24
  Top 0.254: DE1_GPIO.25 4.71,36.82 5.98,38.09 8.02,38.09 10.56,40.63 15.13,40.63 16.45,39.31 IC3.7
N$25
  Top 0.254: DE1_GPIO.26 7.76,36.82 11.06,40.13 14.62,40.13 15.8,38.94 IC3.8
N$26
  Top 0.254: DE1_GPIO.27 4.71,34.28 5.98,35.55 7.51,35.55 11.57,39.62 13.1,39.62 13.85,38.86 IC3.11
N$27
  Top 0.254: DE1_GPIO.28 8.78,34.28 12.08,30.98 13.6,30.98 13.85,31.23 IC3.14
N$28
  Top 0.254: DE1_GPIO.31 4.71,29.2 5.98,30.47 14.62,30.47 15.8,31.66 IC3.17
N$29
  Top 0.254: IC3.18 16.45,31.29 15.13,29.97 7.76,29.97 DE1_GPIO.32
N$30
  Top 0.254: DE1_GPIO.33 4.71,26.66 5.98,27.93 8.02,27.93 9.54,29.46 17.16,29.46 18.4,30.7 IC3.21
N$31
  Top 0.254: DE1_GPIO.34 8.27,26.66 10.56,28.95 17.67,28.95 19.05,30.34 IC3.22
N$32
  Top 0.254: DE1_GPIO.37 4.71,21.58 5.98,22.85 9.03,22.85 10.05,23.87 10.05,25.39 11.57,26.92 15.64,26.92 16.58,25.97 IC4.7
N$33
  Top 0.254: DE1_GPIO.35 4.71,24.12 5.98,25.39 8.02,25.39 10.56,27.93 17.16,27.93 19.18,25.91 IC4.3
N$34
  Top 0.254: DE1_GPIO.36 7.76,24.12 11.06,27.43 16.65,27.43 18.53,25.55 IC4.4
N$35
  Top 0.254: DE1_GPIO.38 9.79,21.58 10.56,22.35 10.56,24.89 12.08,26.41 15.13,26.41 15.93,25.61 IC4.8
N$36
  Top 0.254: DE1_GPIO.39 4.71,19.04 5.98,20.31 9.54,20.31 11.06,21.84 11.06,24.38 12.59,25.9 13.6,25.9 13.98,25.53 IC4.11
N$37
  Top 0.254: DE1_GPIO.40 10.81,19.04 12.59,17.27 13.1,17.27 13.98,18.15 IC4.14
N$38  (via drill 0.6)
  Top 0.254: POTA.6 41.11,45.91 | 41.11,45.91 POTB.3 | CPOT.7 40.88,39.71 v40.19,40.4 | v40.19,44.87 40.19,45 41.11,45.91
  Bottom 0.254: v40.19,40.4 v40.19,44.87
N$39
  Top 0.254: POTB.6 50.86,45.91 D2.1
N$40  (via drill 0.6)
  Top 0.254: POTA.7 38.97,46.67 | 38.97,46.67 POTB.2 | v41.21,47.82 40.12,47.82 38.97,46.67 | CPOT.6 42.56,40.48 41.92,41.11 v41.92,41.82
  Bottom 0.254: v41.92,41.82 41.92,47.11 v41.21,47.82
N$41
  Top 0.254: POTB.7 53.86,46.67 D3.1
N$42  (via drill 0.6)
  Top 0.254: POTA.8 37.6,47.66 38.87,48.93 42.06,48.93 | 42.06,48.93 POTB.1 | CPOT.5 43.5,43.09 v43.55,43.14 | v43.55,49.95 43.08,49.95 42.06,48.93
  Bottom 0.254: v43.55,43.14 v43.55,49.95
N$43
  Top 0.254: POTB.8 50.04,47.5 52.49,49.95 54.34,49.95 D4.1
N$44
  Top 0.254: POTA.5 37.64,45.09 38.47,44.26 38.67,44.06 | 38.67,44.06 38.77,43.96 42.36,43.96 POTB.4 | CPOT.8 40.08,38.89 38.67,40.3 38.67,44.06
N$45
  Top 0.254: POTB.5 47.62,45.09 D1.1
N$46
  Top 0.254: R17.2 47.05,60.21 TR1.B
N$47  (via drill 0.6)
  Top 0.254: J2.8 | v50.15,67.47 arc45 50.25,67.22
  Top 0.406: 50.25,67.22 TR1.C
  Bottom 0.406: J2.8 45.89,79.41 47.2,79.41 48.32,78.3 48.32,76.37 50.15,74.54 50.15,71.9 v50.15,67.47
OPTION
  Top 0.203: IC3.6 17.1,36.83 17.67,36.27 20.92,36.27 21.73,37.08
  Top 0.254: 21.73,37.08 28.79,37.08 EXT_GPIO.25 29.91,36.82 31.15,38.06 32.07,38.06 38.97,31.15 47.1,31.15 EXP.6 49.69,28.97 50.96,27.7 53.5,27.7 54.62,28.82 57.43,28.82 CSL.1
PORTA0
  Top 0.254: IC3.2 19.7,38.61 20.72,39.62 28.79,39.62 EXT_GPIO.23 29.47,39.79 30.13,39.79 30.85,40.6 32.17,40.6 39.69,33.09 61.83,33.09 | 61.83,33.09 65.79,33.09 arc45 65.97,33.16 66.61,33.8 67.54,33.8 arc45 JR1.4 | PA1.4 66.4,28.63 arc-45 66.22,28.7 61.83,33.09
PORTA1
  Top 0.203: 19.58,47.52 19.7,47.64 20.92,47.64 25.39,43.17
  Top 0.254: IC2.23 19.58,47.52 | 25.39,43.17 25.39,42.56 27.32,40.63 30.11,40.63 EXT_GPIO.22 39.59,33.9 64.82,33.9 arc45 65.1,34.02 65.8,34.71 67.39,34.71 arc-45 JR1.3 67.63,34.58 arc45 67.81,34.51 68.13,34.51 68.26,34.38 arc-45 68.34,34.2 68.34,29.73 68.13,29.53 arc-45 67.95,29.45 PA1.3
PORTA2  (via drill 0.6)
  Top 0.203: IC2.20 17.63,47.6 18.07,48.05 21.33,48.05 27.42,41.95 29,41.95 EXT_GPIO.21
  Top 0.254: EXT_GPIO.21 29.07,41.92 29.73,41.92 30.95,43.14 32.17,43.14 40.6,34.71 62.68,34.71 arc45 62.97,34.83 63.56,35.42 v64.07,35.42 67.51,35.42 arc-45 JR1.2 | PA1.2 66.84,30.21 arc-45 66.66,30.29 v65.49,31.46
  Bottom 0.254: v65.49,31.46 65.49,33.89 arc45 65.42,34.07 v64.07,35.42
PORTA3  (via drill 0.6)
  Top 0.203: IC2.19 16.98,47.77 17.67,48.46 21.73,48.46 25.39,44.8 26.61,44.8 28.23,43.17 30.32,43.17 EXT_GPIO.20
  Top 0.254: EXT_GPIO.20 40.71,35.32 61.87,35.32 arc45 62.16,35.44 63.99,37.28 arc-45 64.17,37.35 v65.19,37.35 66.23,36.31 arc45 66.41,36.23 67.54,36.23 arc-45 JR1.1 | PA1.1 67.57,32.12 arc45 v67.4,32.4
  Bottom 0.254: v67.4,32.4 66.2,33.59 66.2,36.23 arc45 66.13,36.41 v65.19,37.35
PORTA4  (via drill 0.6)
  Top 0.203: 17.67,51.3 18.07,50.9 21.33,50.9 22.24,51.81
  Top 0.254: IC2.5 17.67,52.1 17.67,51.3 | 22.24,51.81 26.81,51.81 27.83,50.79 30.32,50.79 EXT_GPIO.14 37.87,52.06 arc45 38.16,52.18 38.57,52.59 60.18,52.59 arc45 60.47,52.71 68.56,60.8 69.27,61.52 | 69.27,61.52 JR2.4 | PA2.4 74.38,72.19 arc-45 74.67,72.07 v75.25,71.49 | v72.3,61.63 69.56,61.63 arc45 69.27,61.52
  Bottom 0.254: v75.25,71.49 75.25,61.8 arc-45 75.13,61.52 74.13,60.52 73.58,60.52 arc-45 73.3,60.64 v72.3,61.63
PORTA5  (via drill 0.6)
  Top 0.254: IC2.2 19.58,53.21 19.7,53.33 27.78,53.33 EXT_GPIO.13 29.61,52.06 30.85,53.3 59.7,53.3 71.59,65.19 72.09,65.19 arc45 JR2.3 72.31,65.22 arc-45 72.6,65.1 72.91,64.78 72.91,62.51 arc45 73.03,62.23 74.84,60.42 75.58,60.42 arc45 75.87,60.53 76.24,60.91 arc45 v76.36,61.19 | PA2.3 73.78,71.36 arc-45 74.07,71.24 75.75,69.56 75.99,69.56 arc-45 76.28,69.44 v76.36,69.36
  Bottom 0.254: v76.36,69.36 v76.36,61.19
PORTA6
  Top 0.203: 19.45,62.84 19.7,63.09 20.92,63.09 28.23,55.77
  Top 0.254: IC1.23 19.45,62.84 | 28.23,55.77 30.22,55.77 EXT_GPIO.10 36.76,57.14 39.89,54.01 59.23,54.01 arc45 59.51,54.13 71.28,65.9 71.96,65.9 arc45 JR2.2 | 72.09,66 arc-45 JR2.2 | PA2.2 arc45 73.63,70.58 73.76,70.58 arc-45 74.04,70.46 74.43,70.07 74.43,69.52 arc-45 74.31,69.24 73.03,67.95 arc45 72.91,67.66 72.91,66.11 72.81,66 arc-45 72.75,65.98 JR2.2
PORTA7
  Top 0.203: 17.5,62.92 18.07,63.49 21.33,63.49 27.83,56.99
  Top 0.254: IC1.20 17.5,62.92 | 27.83,56.99 28.9,56.99 EXT_GPIO.9 29.81,57.14 31.05,58.38 36.33,58.38 39.89,54.83 58.92,54.83 arc45 59.21,54.95 70.98,66.71 71.93,66.71 arc45 JR2.1 72.15,68.18 arc-45 72.27,68.47 PA2.1
PORTA_PROT0
  Top 0.254: JR1.5 74.1,33.81 arc-45 74.39,33.69 X2.1
PORTA_PROT1
  Top 0.254: JR1.6 76.02,34.63 arc-45 76.3,34.52 X2.2
PORTA_PROT2
  Top 0.254: JR1.7 78.06,35.4 arc-45 X2.3
PORTA_PROT3
  Top 0.254: JR1.8 76.23,36.22 arc45 76.52,36.34 X2.4
PORTA_PROT4
  Top 0.254: JR2.5 74.56,64.39 arc-45 74.84,64.27 76.97,62.14 X1.1
PORTA_PROT5
  Top 0.254: JR2.6 77.85,65.22 arc-45 78.13,65.1 X1.2
PORTA_PROT6
  Top 0.254: JR2.7 76.52,65.98 arc45 76.81,66.1 X1.3
PORTA_PROT7
  Top 0.254: JR2.8 75.37,66.8 arc45 75.66,66.92 77.58,68.85 77.58,69.44 arc-45 77.7,69.73 X1.4
POT0
  Top 0.203: 15.03,47.85 15.64,48.46 16.86,48.46 17.26,48.86 22.14,48.86 25.39,45.61 26.61,45.61 27.83,44.39 29,44.39 EXT_GPIO.19
  Top 0.254: IC2.16 15.03,47.85 | EXT_GPIO.19 29.81,44.44 31.05,45.68 33.59,45.68 34.1,45.18 35.99,45.18 POTA.4
POT1
  Top 0.203: 14.38,48.01 15.23,48.86 16.04,48.86 16.45,49.27 22.55,49.27 25.8,46.02 27.42,46.02 27.83,45.61 30.22,45.61 30.32,45.71
  Top 0.254: IC2.15 14.38,48.01 | 30.32,45.71 EXT_GPIO.18 33.3,46.98 34.3,45.99 36,45.99 POTA.3
POT2
  Top 0.203: IC2.10 14.38,51.34 16.04,49.68 22.95,49.68 25.8,46.83 28.9,46.83 EXT_GPIO.17
  Top 0.254: EXT_GPIO.17 29.71,46.98 31.05,48.33 33.08,48.33 34.81,46.6 36,46.6 POTA.2
POT3
  Top 0.203: IC2.9 15.03,51.5 16.45,50.08 25.8,50.08 27.42,48.46
  Top 0.254: 27.42,48.46 27.63,48.25 29.86,48.25 31.13,49.52 EXT_GPIO.16 34.05,49.52 POTA.1
POTIN0
  Top 0.254: D1.2 75.85,38.27 76.97,39.38 80.73,39.38 X2.9
POTIN1
  Top 0.254: D2.2 76.72,42.33 X2.5
POTIN2  (via drill 0.6)
  Top 0.254: D3.2 70.06,46.09 v74.23,50.26
  Bottom 0.254: v74.23,50.26 74.23,55.07 arc-45 74.35,55.35 79.21,60.21 79.85,60.21 arc45 80.14,60.33 83.27,63.46 83.27,69.19 arc45 83.15,69.48 X1.9
POTIN3  (via drill 0.6)
  Top 0.254: D4.2 61.87,49.85 arc45 62.16,49.97 v62.85,50.66
  Bottom 0.254: v62.85,50.66 62.85,65.33 arc-45 62.97,65.61 70.47,73.12 X1.5
PROCEED
  Top 0.203: 16.85,66.75 17.26,66.34 25.39,66.34
  Top 0.254: IC1.6 16.85,66.75 | 25.39,66.34 27.02,64.71 29,64.71 EXT_GPIO.3 29.71,64.76 31.05,66.11 39.69,66.11 42.83,62.96 43.55,62.96 45.88,65.29 45.88,75.96 45.98,76.06 | SIO1.3 38.34,72.07 39.48,73.22 39.48,73.83 39.18,74.13 36.23,74.13 33.49,76.87 33.49,77.99 34.91,79.41 43.34,79.41 43.95,78.81 46.8,78.81 47.71,77.89 47.71,77.18 46.59,76.06 45.98,76.06 | 45.98,76.06 44.38,76.06 J2.9
SELECT
  Top 0.203: IC3.9 15.15,36.75 16.04,35.86 21.33,35.86 21.73,36.27
  Top 0.254: 21.73,36.27 27.63,36.27 28.34,35.55 30.32,35.55 EXT_GPIO.26 32.59,36.82 38.97,30.44 45.63,30.44 46.75,29.33 EXP.4 47.15,28.97 48.42,27.7 49.85,27.7 50.45,27.09 50.45,25.87 51.37,24.96 52.39,24.96 55.53,28.11 57.49,28.11 CSL.2
SIO_CLOCKIN
  Top 0.203: 16.85,63.49 17.26,63.9 21.73,63.9 27.02,58.62
  Top 0.254: IC1.19 16.85,63.49 | 27.02,58.62 27.12,58.62 27.32,58.41 30.32,58.41 EXT_GPIO.8 35.84,59.68 39.99,55.54 50.25,55.54 56.96,62.24 56.96,67.83 | 56.96,67.83 56.96,77.41 J2.1 | SIO2.4 60.02,70.89 56.96,67.83
SIO_CLOCKOUT
  Top 0.203: 14.9,63.98 15.23,64.31 22.14,64.31 26.61,59.84
  Top 0.254: IC1.16 14.9,63.98 | 26.61,59.84 28.9,59.84 EXT_GPIO.7 29.91,59.68 31.15,60.92 35.62,60.92 40.5,56.05 49.74,56.05 55.43,61.74 55.43,80.54 J2.2 57.26,80.63 58.99,78.91 58.99,72.71 59.98,71.72 SIO2.3
SIO_IN
  Top 0.203: 14.82,64.71 22.55,64.71
  Top 0.254: IC1.15 14.25,64.14 14.82,64.71 | 22.55,64.71 26.2,61.06 30.42,61.06 EXT_GPIO.6 35.17,62.22 arc-45 35.46,62.11 40.9,56.66 48.66,56.66 arc45 48.95,56.78 54.42,62.24 54.42,76.53 | 53.6,77.51 J2.3 54.3,76.82 arc-45 54.42,76.53 | 54.42,76.53 54.42,79.55 arc45 54.3,79.84 54.01,80.13 54.01,81.18 arc-45 54.13,81.46 55.03,82.36 56.59,82.36 arc-45 56.87,82.24 60.72,78.4 60.72,73.39 arc45 60.84,73.1 61.33,72.61 62,72.61 arc-45 62.28,72.49 SIO2.2
SIO_IRQ
  Top 0.254: IC1.2 19.45,68.53 20.11,69.18 27.17,69.18 EXT_GPIO.1 29.4,67.3 31.15,69.05 38.63,69.05 | J2.13 37.78,75.55 40.8,75.55 42.02,74.33 42.02,72.3 38.77,69.05 38.63,69.05 | 38.63,69.05 SIO1.1
SIO_OUT
  Top 0.203: 15.23,65.53 22.95,65.53 26.61,61.87
  Top 0.254: IC1.10 14.25,66.51 15.23,65.53 | 26.61,61.87 28.69,61.87 EXT_GPIO.5 29.81,62.22 31.05,63.46 35.11,63.46 41.21,57.37 48.42,57.37 arc-45 48.49,57.54 53.45,62.5 arc45 53.5,62.62 53.5,67.32 52.3,68.53 arc-45 52.18,68.81 52.18,75.38 | 52.18,75.38 J2.5 | 52.18,75.38 52.18,78.81 52.28,78.91 52.28,79.11 53.3,80.13 53.3,82.56 53.71,82.97 57.97,82.97 62.29,78.65 SIO2.1
SIOAUD
  Top 0.254: J2.11 39.71,77.56 43.85,73.42 43.85,70.22 SIOAUD.1
SPARE1
  Top 0.203: IC3.15 14.5,34.02 15.61,35.02 24.71,35.02 26.81,33.01
  Top 0.254: 26.81,33.01 30.32,33.01 EXT_GPIO.28 39.44,26.43 EXP.1
SPARE2
  Top 0.203: IC3.16 15.15,32.84 16.83,34.61 23.74,34.61 EXT_GPIO.31
  Top 0.254: EXT_GPIO.31 29.81,29.2 29.81,29.41 30.85,30.44 34.2,30.44 38.87,25.77 42.73,25.77 43.55,24.96 45.27,24.96 EXP.3
SPARE3
  Top 0.203: IC3.19 17.1,33.26 | 17.1,33.26 | 17.1,33.26 17.94,34.1 22.17,34.1 28.34,27.93
  Top 0.254: 28.34,27.93 30.32,27.93 EXT_GPIO.32
  Bottom 0.254: EXT_GPIO.32 37.88,29.2 39.38,27.7 48.02,27.7 EXP.5
START
  Top 0.203: IC3.10 14.5,36.58 15.53,35.45 25.8,35.45 27.32,34.03 28.79,34.03 EXT_GPIO.27
  Top 0.254: EXT_GPIO.27 29.81,34.28 31.05,35.52 32.88,35.52 38.97,29.43 43.8,29.43 43.8,29.38 EXP.2 44.51,28.97 45.78,27.7 47.31,27.7 48.02,26.99 48.02,25.97 49.64,24.35 52.79,24.35 55.74,27.29 57.49,27.29 CSL.3
TRIG0  (via drill 0.6)
  Top 0.203: IC3.5 17.75,36.99 18.07,36.67 20.31,36.67 21.22,37.59 26.3,37.59 26.61,37.89
  Top 0.254: T0.1 74.18,29.17 v75.96,27.4 | 26.61,37.89 26.81,38.09 30.32,38.09 EXT_GPIO.24 32.08,39.36 arc-45 32.26,39.29 33.69,37.86 39.58,31.97 61.06,31.97 arc-45 61.34,31.85 v63.97,29.22
  Bottom 0.254: X2.6 80.83,31.15 80.83,28.61 79.61,27.4 v75.96,27.4 65.8,27.4 v63.97,29.22
TRIG1
  Top 0.203: 16.98,50.77 17.26,50.49 21.94,50.49 22.24,50.79
  Top 0.254: 80.83,63.46 X1.6 | 80.73,63.36 X1.6 | X1.6 80.93,63.46 80.93,61.33 79.61,60.01 77.38,60.01 75.5,58.13 T1.1 arc45 73.5,58.18 70.37,58.18 64.07,51.88 39.89,51.88 38.77,50.76 30.95,50.76 29.71,49.52 EXT_GPIO.15 28.79,49.78 27.83,49.78 26.81,50.79 22.24,50.79 | IC2.6 16.98,50.77

### Text on the board
tNames: DE1 Atari XL SIO/Joystick / board V1.1 / (c) 2015 Mark Watson / and Matthias Reichl